# Altium schematic sheet Analog.SchDoc
size A4
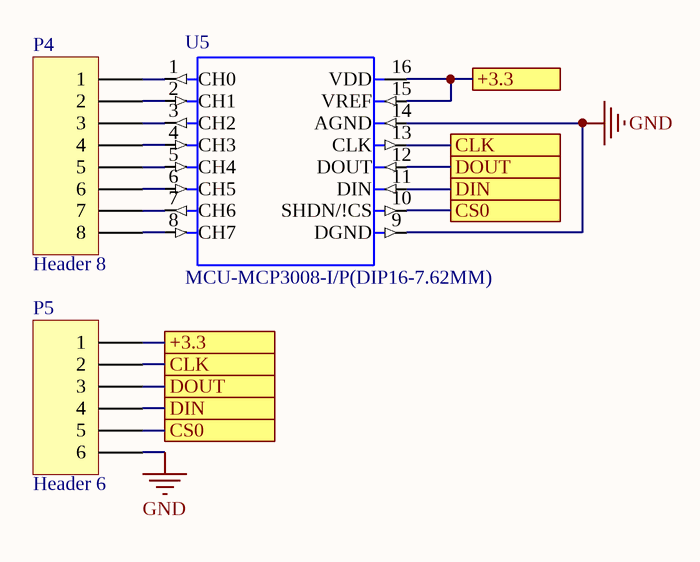
[diagram p0: Analog.SchDoc]

## Parts
P4  Header 8  [HDR1X8]
P5  Header 6  [HDR1X6]
U5  MCU-MCP3008-I/P(DIP16-7.62MM)  [DIP16-2.54-19.2X7.62MM]

## Ports
+3.3, CLK, CS0, DIN, DOUT

## Nets
GND: P5.6 U5.9(DGND) U5.14(AGND)
+3.3: P5.1 U5.15(VREF) U5.16(VDD) ; port +3.3
CLK: P5.2 U5.13(CLK) ; port CLK
CS0: P5.5 U5.10(SHDN/!CS) ; port CS0
DIN: P5.4 U5.11(DIN) ; port DIN
DOUT: P5.3 U5.12(DOUT) ; port DOUT
NetP4_1: P4.1 U5.1(CH0)
NetP4_2: P4.2 U5.2(CH1)
NetP4_3: P4.3 U5.3(CH2)
NetP4_4: P4.4 U5.4(CH3)
NetP4_5: P4.5 U5.5(CH4)
NetP4_6: P4.6 U5.6(CH5)
NetP4_7: P4.7 U5.7(CH6)
NetP4_8: P4.8 U5.8(CH7)

## Library data of the parts
P4 = Header 8: Header, 8-Pin; LatestRevisionDate: 17-Jul-2002; LatestRevisionNote: Re-released for DXP Platform.; Publisher: Altium Limited
P5 = Header 6: Header, 6-Pin; LatestRevisionDate: 17-Jul-2002; LatestRevisionNote: Re-released for DXP Platform.; Publisher: Altium Limited
U5 = MCU-MCP3008-I/P(DIP16-7.62MM): 10 Bit Analog to Digital Converter 4, 8 Input 1 SAR 16-PDIP; MF: Microchip; Package: DIP-16 Microchip; Value: *; Availability: Unavailable; SnapEDA_Link: https://www.snapeda.com/parts/MCP3008-I/P/Microchip/view-part/43628/?ref=snap; Price: None; MP: MCP3008-I/P